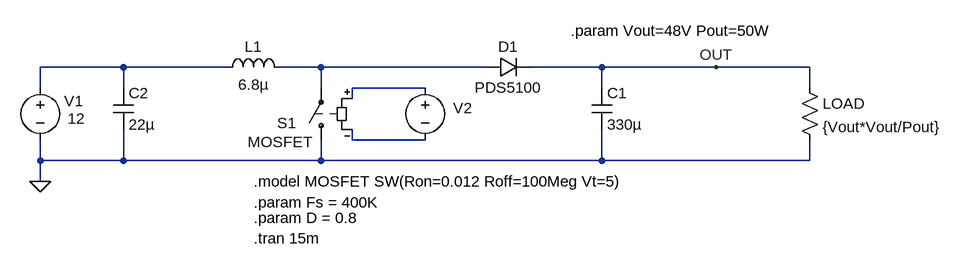
[diagram p0: schematic _Pattern.asc]
_Pattern.asc, the LTspice schematic file:
Version 4.1
SHEET 1 1244 680
WIRE -240 96 -368 96
WIRE -80 96 -240 96
WIRE 64 96 0 96
WIRE 320 96 64 96
WIRE 496 96 384 96
WIRE 672 96 496 96
WIRE 816 96 672 96
WIRE -368 128 -368 96
WIRE -240 128 -240 96
WIRE 64 128 64 96
WIRE 224 128 112 128
WIRE 496 128 496 96
WIRE 816 128 816 96
WIRE 112 144 112 128
WIRE 112 208 112 192
WIRE 224 208 112 208
WIRE -368 240 -368 208
WIRE -240 240 -240 192
WIRE -240 240 -368 240
WIRE 64 240 64 208
WIRE 64 240 -240 240
WIRE 496 240 496 192
WIRE 496 240 64 240
WIRE 816 240 816 208
WIRE 816 240 496 240
WIRE -368 272 -368 240
FLAG -368 272 0
FLAG 672 96 OUT
SYMBOL voltage -368 112 R0
WINDOW 123 0 0 Left 0
WINDOW 39 0 0 Left 0
WINDOW 0 37 36 Left 2
WINDOW 3 42 63 Left 2
SYMATTR InstName V1
SYMATTR Value 12
SYMBOL diode 320 112 R270
WINDOW 0 32 32 VTop 2
WINDOW 3 0 32 VBottom 2
SYMATTR InstName D1
SYMATTR Value PDS5100
SYMBOL ind -96 112 R270
WINDOW 0 32 56 VTop 2
WINDOW 3 5 56 VBottom 2
SYMATTR InstName L1
SYMATTR Value 6.8µ
SYMATTR SpiceLine Rser=13.1m
SYMBOL cap 480 128 R0
SYMATTR InstName C1
SYMATTR Value 330µ
SYMBOL res 800 112 R0
SYMATTR InstName LOAD
SYMATTR Value {Vout*Vout/Pout}
SYMBOL sw 64 224 R180
WINDOW 3 12 13 Left 2
WINDOW 0 38 42 Left 2
SYMATTR Value MOSFET
SYMATTR InstName S1
SYMBOL voltage 224 112 R0
WINDOW 0 58 31 Top 2
WINDOW 3 37 190 Invisible 2
WINDOW 123 0 0 Left 0
WINDOW 39 0 0 Left 0
SYMATTR InstName V2
SYMATTR Value PULSE(0 12 0 1n 1n {D/Fs} {1/Fs})
SYMBOL cap -256 128 R0
SYMATTR InstName C2
SYMATTR Value 22µ
TEXT -40 360 Left 2 !.tran 15m
TEXT -40 272 Left 2 !.model MOSFET SW(Ron=0.012 Roff=100Meg Vt=5)
TEXT -40 304 Left 2 !.param Fs = 400K
TEXT -40 328 Left 2 !.param D = 0.8
TEXT 448 40 Left 2 !.param Vout=48V Pout=50W

The netlist it stands for:
* _Pattern.asc
V1 N001 0 12
D1 N002 OUT PDS5100
L1 N001 N002 6.8µ Rser=13.1m
C1 OUT 0 330µ
R§LOAD OUT 0 {Vout*Vout/Pout}
S1 0 N002 N003 N004 MOSFET
V2 N003 N004 PULSE(0 12 0 1n 1n {D/Fs} {1/Fs})
C2 N001 0 22µ
.model D D
.lib standard.dio
.tran 15m
.model MOSFET SW(Ron=0.012 Roff=100Meg Vt=5)
.param Fs = 400K
.param D = 0.8
.param Vout=48V Pout=50W
.backanno
.end